# EAGLE design bikelights (EAGLE 6.4)
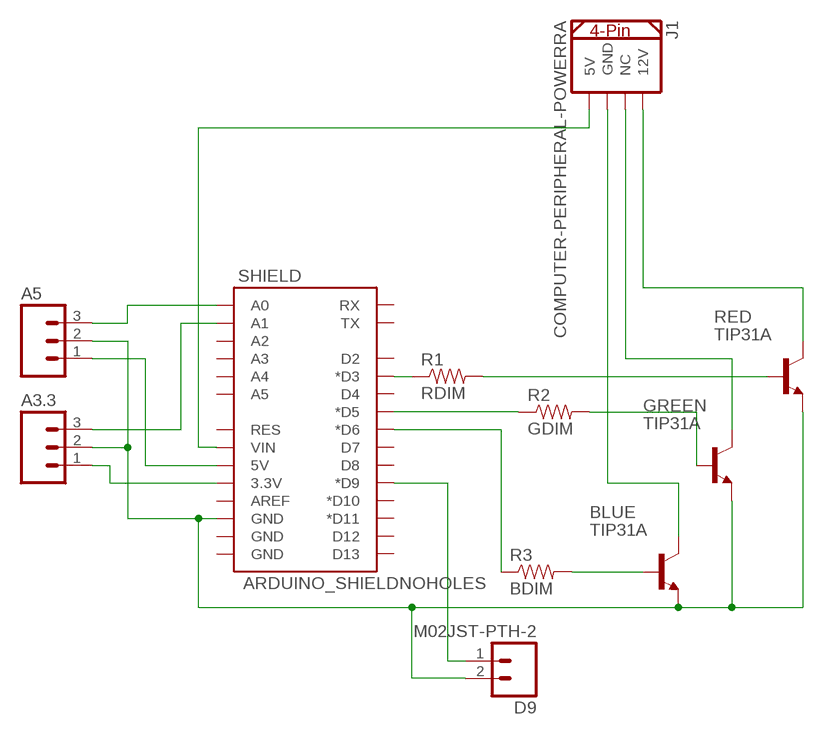
[diagram p0: schematic, sheet 1]

## Parts
A3.3  M03JST-PTH  [JST-3-PTH]
A5  M03JST-PTH  [JST-3-PTH]
BLUE  TIP31A  [TO220]
D9  M02JST-PTH-2  [JST-2-PTH]
GREEN  TIP31A  [TO220]
J1  COMPUTER-PERIPHERAL-POWERRA  [COMPUTER-PERIPHERAL-POWER-RA]
R1  RDIM  RESISTOREZ  [AXIAL-0.3EZ]
R2  GDIM  RESISTOREZ  [AXIAL-0.3EZ]
R3  BDIM  RESISTOREZ  [AXIAL-0.3EZ]
RED  TIP31A  [TO220]
SHIELD  ARDUINO_SHIELDNOHOLES  [DUEMILANOVE_SHIELD_NOHOLES]

## Nets
N$1: R1.P$1 SHIELD.D3(*D3)
N$2: GREEN.1(B) R2.P$2
N$3: BLUE.1(B) R3.P$2
N$4: A3.3.2 A5.2 BLUE.3(E) D9.2 GREEN.3(E) RED.3(E) SHIELD.GND@2(GND)
N$5: BLUE.2(C) J1.GND
N$6: GREEN.2(C) J1.NC
N$7: J1.12V RED.2(C)
N$8: J1.5V SHIELD.VIN
N$9: R2.P$1 SHIELD.D5(*D5)
N$10: R3.P$1 SHIELD.D6(*D6)
N$11: R1.P$2 RED.1(B)
N$12: A5.1 SHIELD.5V
N$13: D9.1 SHIELD.D9(*D9)
N$14: A5.3 SHIELD.A0
N$15: A3.3.3 SHIELD.A1
N$16: A3.3.1 SHIELD.3.3V
Unconnected: SHIELD.A2 SHIELD.A3 SHIELD.A4 SHIELD.A5 SHIELD.AREF SHIELD.D2 SHIELD.D4 SHIELD.D7 SHIELD.D8 SHIELD.D10(*D10) SHIELD.D11(*D11) SHIELD.D12 SHIELD.D13 SHIELD.GND@0(GND) SHIELD.GND@1(GND) SHIELD.RES SHIELD.RX SHIELD.TX

## Library data of the parts
A3.3 A5 = SparkFun-Connectors:M03: Header 3 Standard 3-pin 0.1" header. Use with straight break away headers (SKU : PRT-00116), right angle break away headers (PRT-00553), swiss pins (PRT-00743), machine pins (PRT-00117), and female headers (PRT-00115). Molex polarized connector foot print use with SKU : PRT-08232 with associated crimp pins and housings.; SKU: PRT-09915
BLUE GREEN RED = transistor:TIP31: NPN Transistor Medium Power Linear Switching Applications Source: http://onsemi.com
D9 = SparkFun-Connectors:M02: Standard 2-pin 0.1" header. Use with - straight break away headers ( PRT-00116) - right angle break away headers (PRT-00553) - swiss pins (PRT-00743) - machine pins (PRT-00117) - female headers (PRT-00115) Molex polarized connector foot print use with: PRT-08233 with associated crimp pins and housings. 2.54_SCREWTERM for use with PRT-10571. 3.5mm Screw Terminal footprints for PRT-08084 5mm Screw Terminal footprints for use with PRT-08433; SKU: PRT-09914
J1 = SparkFun-Connectors:COMPUTER-PERIPHERAL-POWER
R1-R3 = SparkFun-Passives:RESISTOR: Resistor Basic schematic elements and footprints for 0603, 1206, and PTH resistors.
SHIELD = SparkFun-Boards:ARDUINO_SHIELD: Arduino shield footprint

## Board
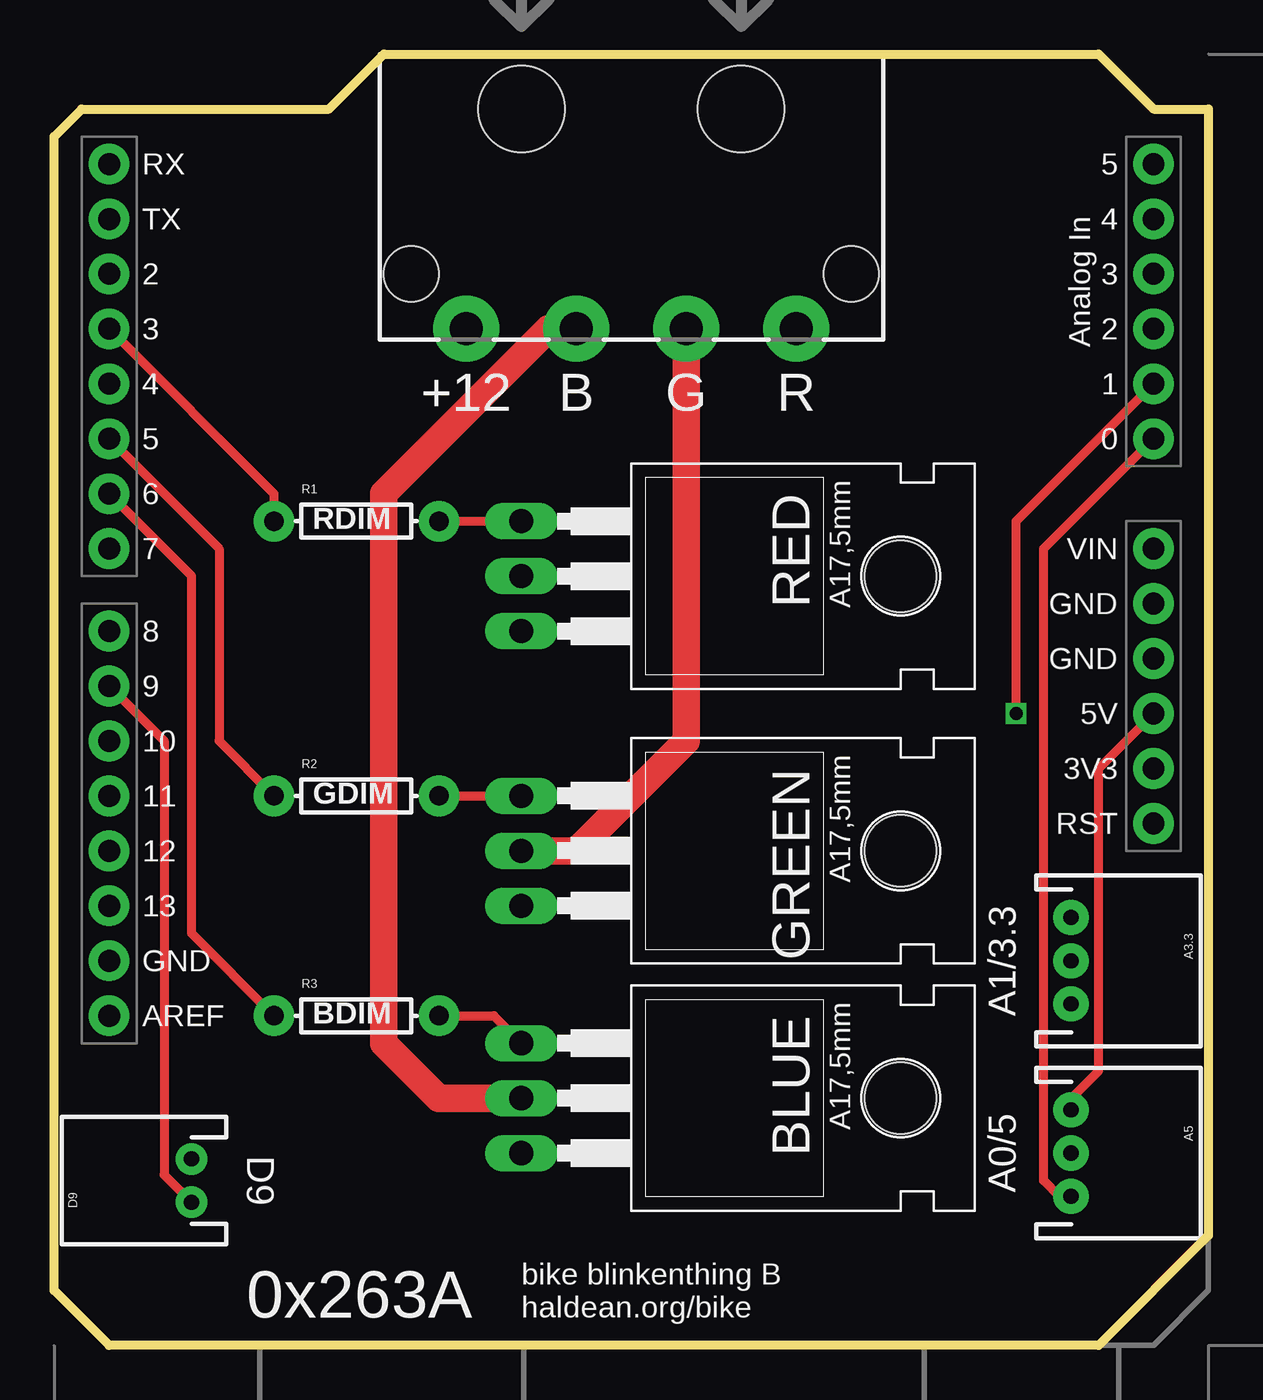
[diagram p1: board, top side]
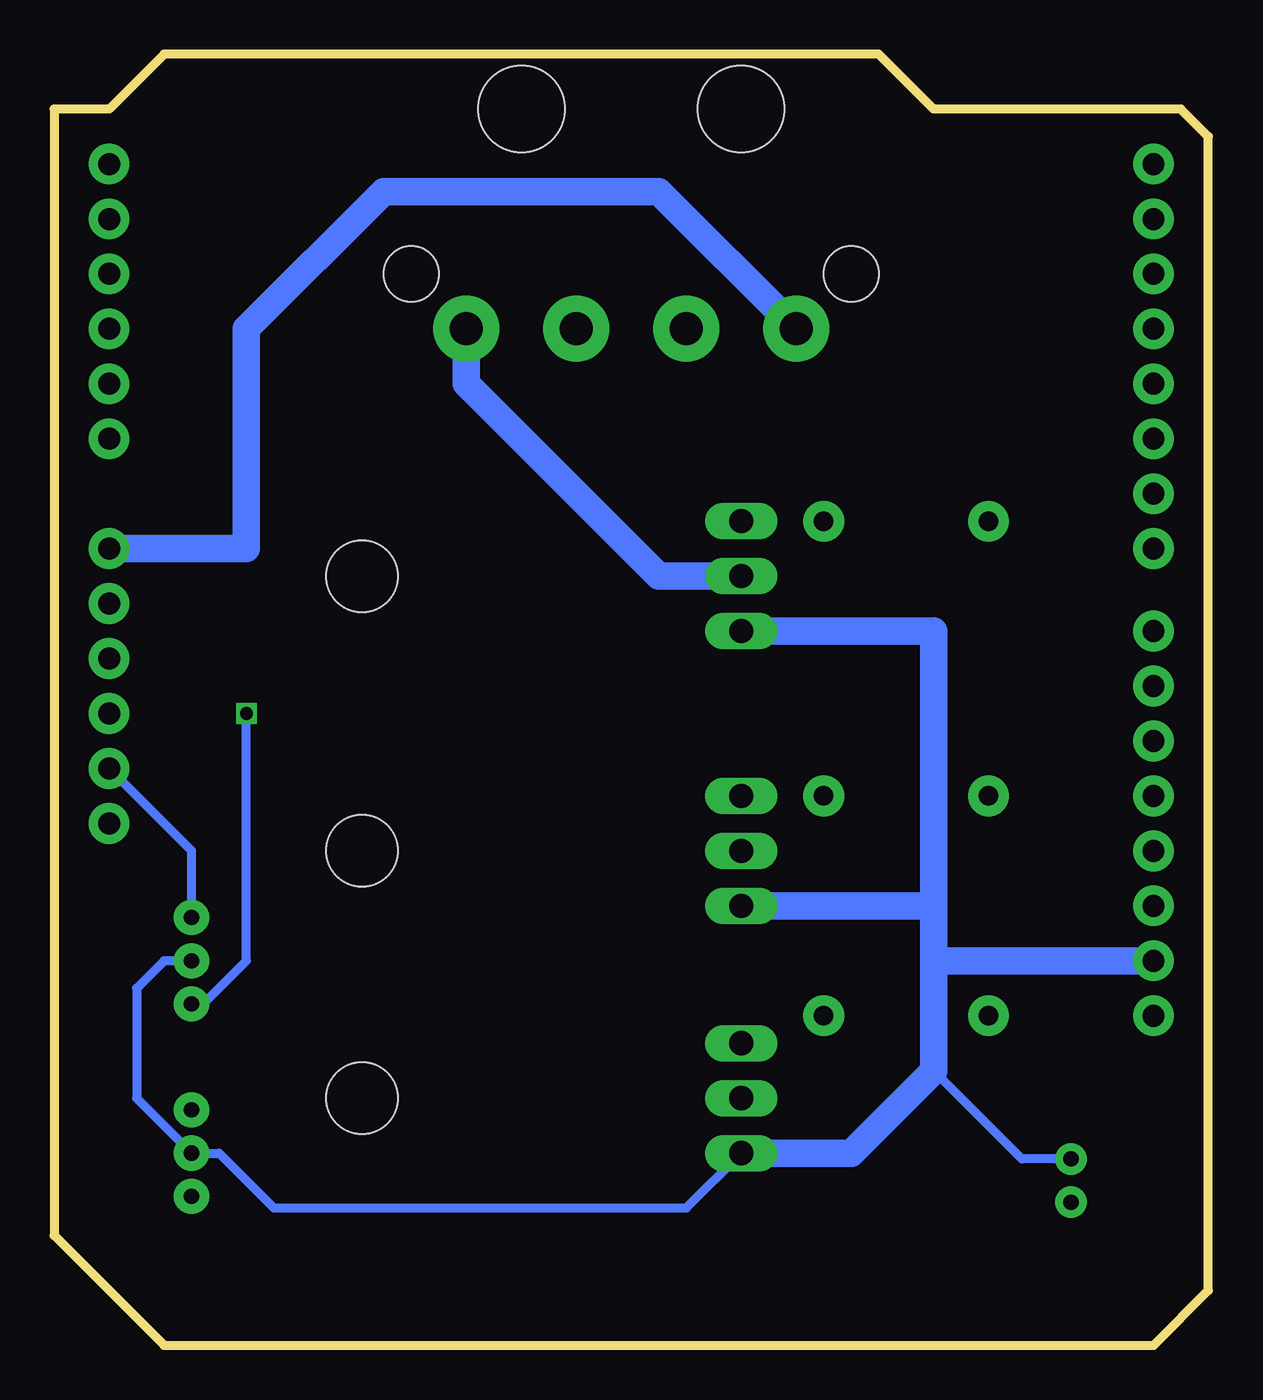
[diagram p2: board, bottom side, seen from below]

Size 53.34 x 59.69 mm. Coordinates in mm from the lower left corner, seen from the top.
Outline: 0,2.54 0,55.88 1.27,57.15 12.7,57.15 15.24,59.69 48.26,59.69 50.8,57.15 53.34,57.15 53.34,5.08 48.26,0 2.54,0 0,2.54
Copper layers (1*16): Top 0.0356mm / dielectric 1.5011mm / Bottom 0.0356mm
Design rules "OshParkPCBOrder *": minimum track width 6mil, minimum drill 13mil, track to track 6mil, track to pad 6mil, pad to pad 6mil, via to via 6mil, smd to smd 6mil, copper to edge 15mil, drill to drill 6mil, minimum pad ring 7mil, minimum via ring 7mil, stop-mask expansion 3mil, vias tented up to drill 0mil, thermal gap 10mil

### Footprints (pad centres in the part's own frame; a part is rotated, then mirrored left to right if it is on the bottom)
JST-3-PTH = drill 0.7 pad 1.626: 1 -2,0; 2 0,0; 3 2,0
TO220 = drill 1.118 long: 1 -2.54,-6.35; 2 0,-6.35; 3 2.54,-6.35 | hole 3.302: 0,11.176
JST-2-PTH = drill 0.7 pad 1.448: 1 -1,0; 2 1,0
COMPUTER-PERIPHERAL-POWER-RA = drill 1.524 pad 3.048: 5V -7.62,-2.54; 12V 7.62,-2.54; GND -2.54,-2.54; NC 2.54,-2.54 | hole 2.54: -10.16,0; 10.16,0 | hole 3.988: -5.08,7.62; 5.08,7.62
AXIAL-0.3EZ = drill 0.9 pad 1.88: P$1 -3.81,0; P$2 3.81,0
DUEMILANOVE_SHIELD_NOHOLES = drill 1.016 pad 1.88: 3.3V 50.8,26.67; 5V 50.8,29.21; A0 50.8,41.91; A1 50.8,44.45; A2 50.8,46.99; A3 50.8,49.53; A4 50.8,52.07; A5 50.8,54.61; AREF 2.54,15.24; D2 2.54,49.53; D3 2.54,46.99; D4 2.54,44.45; D5 2.54,41.91; D6 2.54,39.37; D7 2.54,36.83; D8 2.54,33.02; D9 2.54,30.48; D10 2.54,27.94; D11 2.54,25.4; D12 2.54,22.86; D13 2.54,20.32; GND@0 50.8,31.75; GND@1 50.8,34.29; GND@2 2.54,17.78; RES 50.8,24.13; RX 2.54,54.61; TX 2.54,52.07; VIN 50.8,36.83

### Placement (x,y rotation side)
A3.3  46.99,17.78 270 top
A5  46.99,8.89 270 top
BLUE  27.94,11.43 270 top
D9  6.35,7.62 90 top
GREEN  27.94,22.86 270 top
J1  26.67,49.53 0 top
R1  13.97,38.1 0 top
R2  13.97,25.4 0 top
R3  13.97,15.24 0 top
RED  27.94,35.56 270 top
SHIELD  0,0 0 top

### Tracks (layer width: path | path; a pad name or v marks a point on that pad's centre or on a via)
N$1
  Top 0.406: SHIELD.D3 10.16,39.37 R1.P$1
N$2
  Top 0.406: R2.P$2 GREEN.1
N$3
  Top 0.406: R3.P$2 20.32,15.24 BLUE.1
N$4
  Bottom 0.406: D9.2 8.62,8.62 12.7,12.7 | BLUE.3 24.13,6.35 43.18,6.35 45.72,8.89 A5.2 49.53,11.43 49.53,16.51 48.26,17.78 A3.3.2
  Bottom 1.27: RED.3 12.7,33.02 12.7,20.32 | 12.7,20.32 12.7,17.78 | 12.7,17.78 SHIELD.GND@2 | GREEN.3 12.7,20.32 | BLUE.3 16.51,8.89 12.7,12.7 12.7,17.78
N$5
  Top 1.27: J1.GND 22.86,46.99 15.24,39.37 15.24,13.97 17.78,11.43 BLUE.2
N$6
  Top 1.27: J1.NC 29.21,27.94 24.13,22.86 GREEN.2
N$7
  Bottom 1.27: J1.12V 34.29,44.45 25.4,35.56 RED.2
N$8
  Bottom 1.27: J1.5V 25.4,53.34 38.1,53.34 44.45,46.99 44.45,36.83 SHIELD.VIN
N$9
  Top 0.406: SHIELD.D5 7.62,36.83 7.62,27.94 R2.P$1
N$10
  Top 0.406: R3.P$1 6.35,19.05 6.35,35.56 SHIELD.D6
N$11
  Top 0.406: R1.P$2 RED.1
N$12
  Top 0.406: A5.1 46.99,11.43 48.26,12.7 48.26,26.67 SHIELD.5V
N$13
  Top 0.406: SHIELD.D9 5.08,27.94 5.08,7.89 D9.1
N$14
  Top 0.406: A5.3 46.45,6.89 45.72,7.62 45.72,36.83 SHIELD.A0
N$15  (via drill 0.6)
  Top 0.406: v44.45,29.21 44.45,38.1 SHIELD.A1
  Bottom 0.406: A3.3.3 46.45,15.78 44.45,17.78 v44.45,29.21
N$16
  Bottom 0.406: A3.3.1 46.99,22.86 SHIELD.3.3V

### Text on the board
tNames: +12 | B | G | R | A1/3.3 | A0/5 | D9 | 0x263A | bike blinkenthing B / haldean.org/bike